# EAGLE design atmega_midi_pg800 (EAGLE 7.6.0)
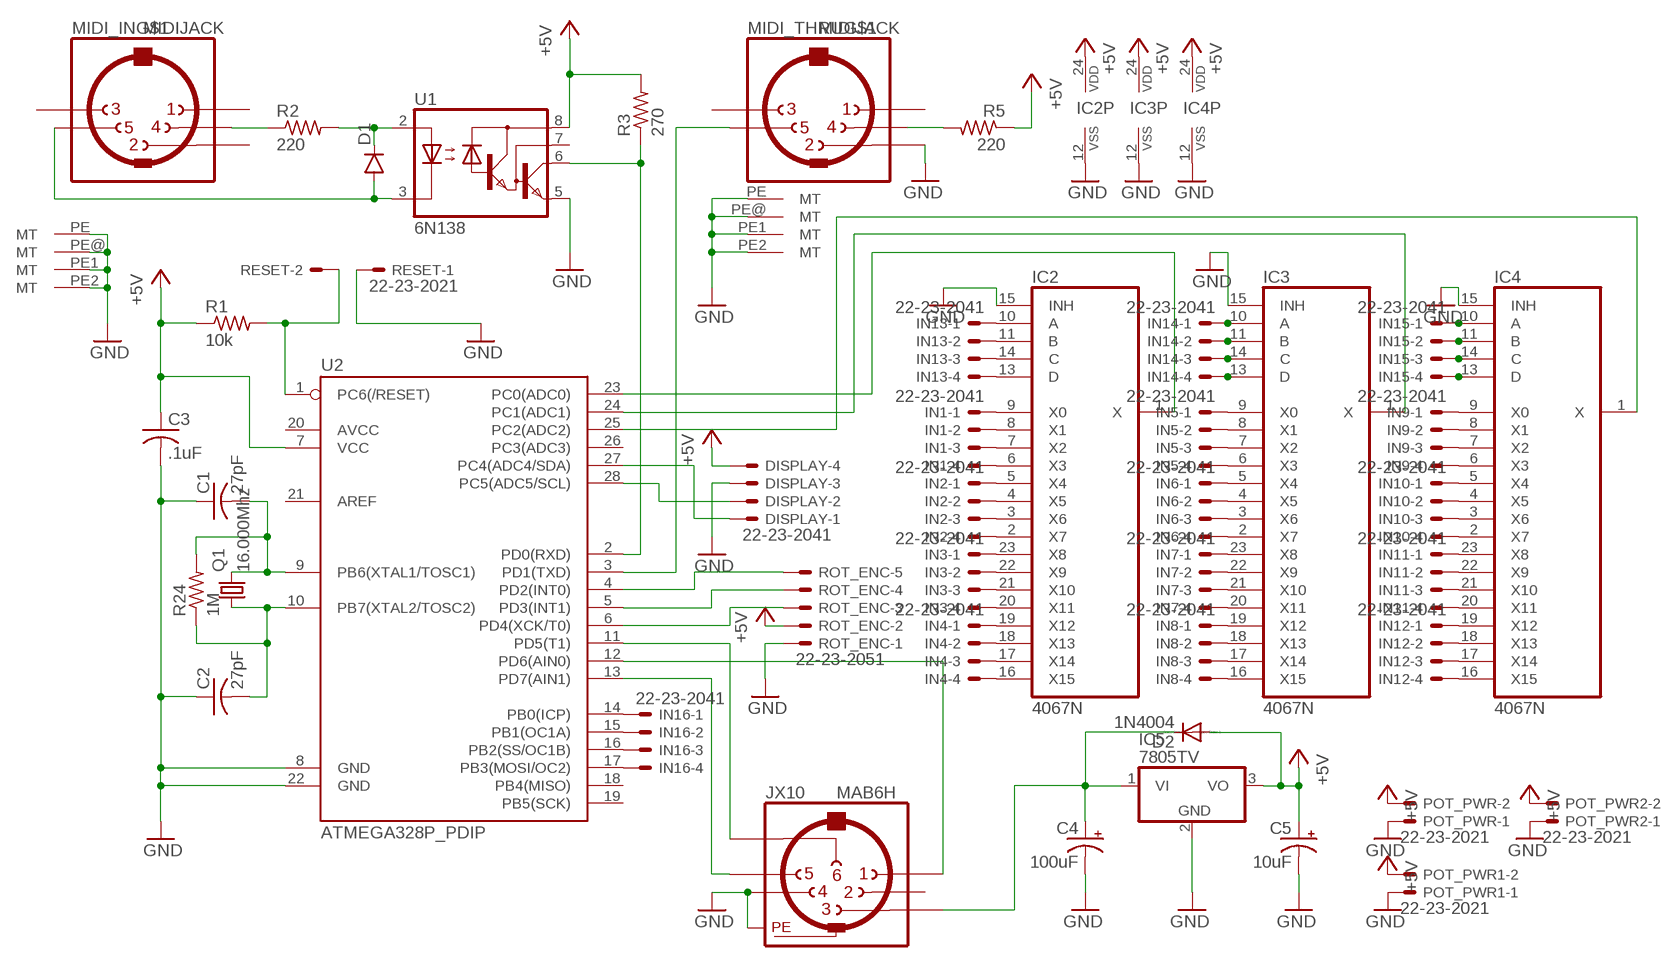
[diagram p0: schematic, sheet 1]

## Parts
C1  27pF  C-US025-040X050  [C025-040X050]
C2  27pF  C-US025-040X050  [C025-040X050]
C3  .1uF  C-US025-030X050  [C025-030X050]
C4  100uF  CPOL-USB45181A  [B45181A]
C5  10uF  CPOL-USB45181A  [B45181A]
D1  DIODE1N4148  [DIODE-1N4148]
D2  1N4004  [DO41-10]
DISPLAY  22-23-2041  [22-23-2041]
IC2  4067N  [DIL24-6]
IC3  4067N  [DIL24-6]
IC4  4067N  [DIL24-6]
IC5  7805TV  [TO220V]
IN1  22-23-2041  [22-23-2041]
IN2  22-23-2041  [22-23-2041]
IN3  22-23-2041  [22-23-2041]
IN4  22-23-2041  [22-23-2041]
IN5  22-23-2041  [22-23-2041]
IN6  22-23-2041  [22-23-2041]
IN7  22-23-2041  [22-23-2041]
IN8  22-23-2041  [22-23-2041]
IN9  22-23-2041  [22-23-2041]
IN10  22-23-2041  [22-23-2041]
IN11  22-23-2041  [22-23-2041]
IN12  22-23-2041  [22-23-2041]
IN13  22-23-2041  [22-23-2041]
IN14  22-23-2041  [22-23-2041]
IN15  22-23-2041  [22-23-2041]
IN16  22-23-2041  [22-23-2041]
JX10  MAB6H  [MAB6H]
MIDI_IN  MIDIJACK  [CP-2350]
MIDI_THRU  MIDIJACK  [CP-2350]
POT_PWR  22-23-2021  [22-23-2021]
POT_PWR1  22-23-2021  [22-23-2021]
POT_PWR2  22-23-2021  [22-23-2021]
Q1  16.000Mhz  CRYSTALHC49S  [HC49/S]
R1  10k  R-US_0207/7  [0207/7]
R2  220  R-US_0207/7  [0207/7]
R3  270  R-US_0207/7  [0207/7]
R5  220  R-US_0309/10  [0309/10]
R24  1M  R-US_0207/7  [0207/7]
RESET  22-23-2021  [22-23-2021]
ROT_ENC  22-23-2051  [22-23-2051]
U1  6N138  [DIL08]
U2  ATMEGA328P_PDIP  [DIL28-3]

## Nets
+5V: C3.1 C5.+ D2.A DISPLAY.4 IC2.24(VDD) IC3.24(VDD) IC4.24(VDD) IC5.3(VO) POT_PWR1.2 POT_PWR2.2 POT_PWR.2 R1.1 R3.2 R5.1 ROT_ENC.2 U1.8(VCC) U2.7(VCC)
GND: C1.1 C2.1 C3.2 C4.- C5.- DISPLAY.3 IC2.12(VSS) IC2.15(INH) IC3.12(VSS) IC3.15(INH) IC4.12(VSS) IC4.15(INH) IC5.2(GND) JX10.4 JX10.PE JX10.PE@(PE) MIDI_IN.PE1(MT) MIDI_IN.PE2(MT) MIDI_IN.PE(MT) MIDI_IN.PE@(MT) MIDI_THRU.2 MIDI_THRU.PE1(MT) MIDI_THRU.PE2(MT) MIDI_THRU.PE(MT) MIDI_THRU.PE@(MT) POT_PWR1.1 POT_PWR2.1 POT_PWR.1 RESET.1 ROT_ENC.1 U1.5(GND) U2.8(GND) U2.22(GND)
N$1: MIDI_THRU.4 R5.2
N$2: IC4.1(X) U2.25(PC2(ADC2))
N$3: D1.A MIDI_IN.5 U1.3(C)
N$4: C1.2 Q1.2 R24.2 U2.9(PB6(XTAL1/TOSC1))
N$5: C2.2 Q1.1 R24.1 U2.10(PB7(XTAL2/TOSC2))
N$6: C4.+ D2.C IC5.1(VI) JX10.3
N$7: D1.C R2.2 U1.2(A)
N$8: MIDI_IN.4 R2.1
N$9: JX10.6 U2.11(PD5(T1))
N$10: JX10.1 U2.12(PD6(AIN0))
N$11: JX10.5 U2.13(PD7(AIN1))
N$12: DISPLAY.2 U2.28(PC5(ADC5/SCL))
N$13: DISPLAY.1 U2.27(PC4(ADC4/SDA))
N$14: IC3.1(X) U2.24(PC1(ADC1))
N$15: IC2.1(X) U2.23(PC0(ADC0))
N$16: IN16.1 U2.14(PB0(ICP))
N$17: IN16.2 U2.15(PB1(OC1A))
N$18: IC3.10(A) IN14.1
N$19: IC3.11(B) IN14.2
N$20: IC2.9(X0) IN1.1
N$21: IC2.8(X1) IN1.2
N$22: IC2.7(X2) IN1.3
N$23: IC2.6(X3) IN1.4
N$24: IC2.5(X4) IN2.1
N$25: IC2.4(X5) IN2.2
N$26: IC2.3(X6) IN2.3
N$27: IC2.2(X7) IN2.4
N$28: IC2.23(X8) IN3.1
N$29: IC2.22(X9) IN3.2
N$30: R3.1 U1.6(VO) U2.2(PD0(RXD))
N$31: IC2.21(X10) IN3.3
N$32: IC2.20(X11) IN3.4
N$33: IC2.19(X12) IN4.1
N$34: IC2.18(X13) IN4.2
N$35: IC2.17(X14) IN4.3
N$36: IC2.16(X15) IN4.4
N$37: IC3.9(X0) IN5.1
N$38: IC3.8(X1) IN5.2
N$39: IC3.7(X2) IN5.3
N$40: IC3.6(X3) IN5.4
N$41: IC3.5(X4) IN6.1
N$42: MIDI_THRU.5 U2.3(PD1(TXD))
N$43: R1.2 RESET.2 U2.1(PC6(/RESET))
N$44: IC3.4(X5) IN6.2
N$45: IC3.3(X6) IN6.3
N$46: IC3.2(X7) IN6.4
N$47: IC3.23(X8) IN7.1
N$48: IC3.22(X9) IN7.2
N$49: IC3.21(X10) IN7.3
N$50: IC3.20(X11) IN7.4
N$51: IC3.19(X12) IN8.1
N$52: IC3.18(X13) IN8.2
N$53: IC3.17(X14) IN8.3
N$54: IC3.16(X15) IN8.4
N$55: IC4.9(X0) IN9.1
N$56: IC4.8(X1) IN9.2
N$57: IC4.7(X2) IN9.3
N$58: IC4.6(X3) IN9.4
N$59: IC4.5(X4) IN10.1
N$60: IC4.4(X5) IN10.2
N$61: IC4.3(X6) IN10.3
N$62: IC4.2(X7) IN10.4
N$63: IC4.23(X8) IN11.1
N$64: IC4.22(X9) IN11.2
N$65: IC4.21(X10) IN11.3
N$66: IC4.20(X11) IN11.4
N$67: IC4.19(X12) IN12.1
N$68: IC4.18(X13) IN12.2
N$69: IC4.17(X14) IN12.3
N$70: IC4.16(X15) IN12.4
N$71: IC3.14(C) IN14.3
N$72: IC3.13(D) IN14.4
N$73: IC4.10(A) IN15.1
N$74: IC4.11(B) IN15.2
N$75: IC4.14(C) IN15.3
N$76: IC4.13(D) IN15.4
N$77: IN16.3 U2.16(PB2(SS/OC1B))
N$78: IN16.4 U2.17(PB3(MOSI/OC2))
N$80: IC2.13(D) IN13.4
N$81: IC2.14(C) IN13.3
N$82: IC2.11(B) IN13.2
N$83: IC2.10(A) IN13.1
N$84: ROT_ENC.5 U2.4(PD2(INT0))
N$85: ROT_ENC.4 U2.5(PD3(INT1))
N$86: ROT_ENC.3 U2.6(PD4(XCK/T0))
Unconnected: JX10.2 MIDI_IN.1 MIDI_IN.2 MIDI_IN.3 MIDI_THRU.1 MIDI_THRU.3 U1.7(VB) U2.18(PB4(MISO)) U2.19(PB5(SCK)) U2.20(AVCC) U2.21(AREF) U2.26(PC3(ADC3))

## Library data of the parts
C1-C3 = rcl:C-US: CAPACITOR, American symbol
C4 C5 = rcl:CPOL-US: POLARIZED CAPACITOR, American symbol
D1 = SparkFun-DiscreteSemi:DIODE: Diode These are standard reverse protection diodes and small signal diodes. SMA package can handle up to about 1A. SOD-323 can handle about 200mA. What the SOD-323 package when ordering, there are some mfgs out there that are 5-pin packages.
D2 = diode:1N4004: DIODE general purpose rectifier, 1 A
DISPLAY IN1-IN16 = con-molex:22-23-2041: .100" (2.54mm) Center Header - 4 Pin; MF: MOLEX; MPN: 22-23-2041; OC_FARNELL: 1462920; OC_NEWARK: 38C0355
IC2-IC4 = 40xx:4067: 16-channel ANALOG MULTIPLEXER
IC5 = linear:78*: Positive VOLTAGE REGULATOR Source: http://cache.national.com/ds/LM/LM78L05.pdf http://www.fairchildsemi.com/ds/LM/LM7805.pdf
JX10 = con-hirschmann:MAB6H: Female CONNECTOR 6 pins with shield, horizontal (DIN 45322); MF: FARNELL; MPN: MAB 6 H; OC_FARNELL: 809901; OC_NEWARK: 67C7887
MIDI_IN MIDI_THRU = adafruit:MIDIJACK: DIN 5 jack also known as MIDI jack A modification of conn-hirshman:MAB5SH with two options for the grounding 'teeth'
POT_PWR POT_PWR1 POT_PWR2 RESET = con-molex:22-23-2021: .100" (2.54mm) Center Header - 2 Pin; MF: MOLEX; MPN: 22-23-2021; OC_FARNELL: 1462926; OC_NEWARK: 25C3832
Q1 = crystal:CRYSTAL: CRYSTAL; OC_FARNELL: 1667008; OC_NEWARK: unknown
R1-R3 R5 R24 = rcl:R-US_: RESISTOR, American symbol
ROT_ENC = con-molex:22-23-2051: .100" (2.54mm) Center Header - 5 Pin; MF: MOLEX; MPN: 22-23-2051; OC_FARNELL: 1462952; OC_NEWARK: 38C9178
U1 = optocoupler:6N138: MOTOROLA OPTO COUPLER; MF: VISHAY/TELEFUNKEN; MPN: 6N138; OC_FARNELL: 9860150; OC_NEWARK: 35K5294
U2 = SparkFun-DigitalIC:ATMEGA328P_PDIP: uC used in the Arduino 32kb flash, 1k EEPROM, 2k SRAM This is the through-hole version of this chip.

## Net classes
1 GND: width 1.016 mm, drill 1.016 mm, clearance 0.508 mm

## Board
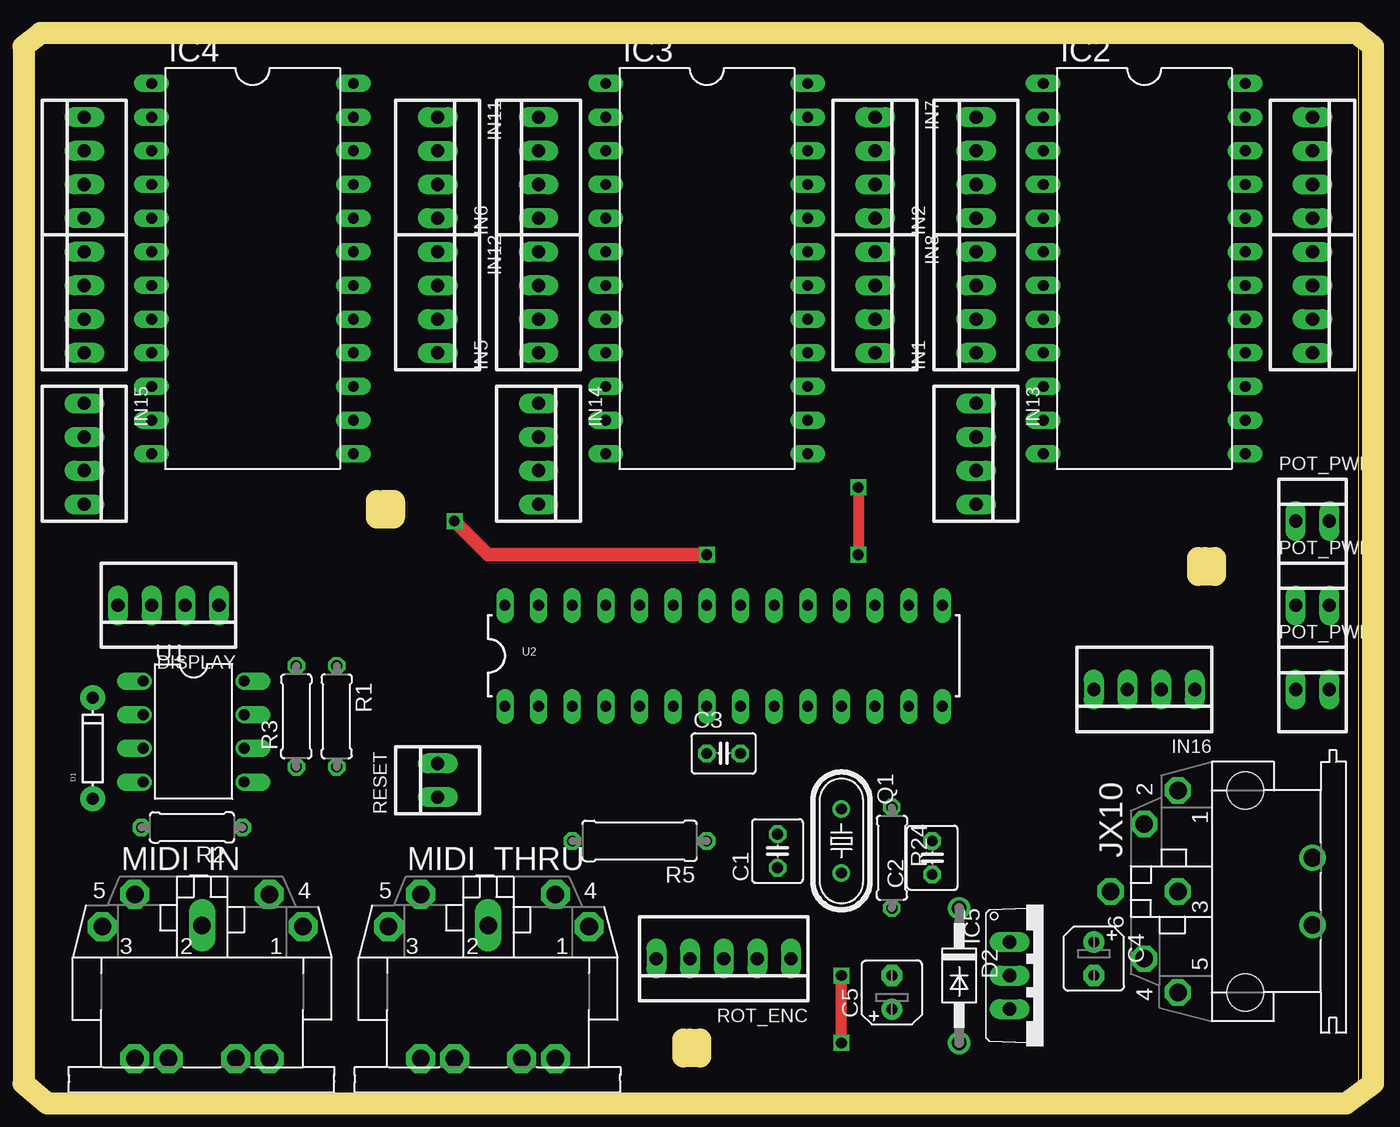
[diagram p1: board, top side]
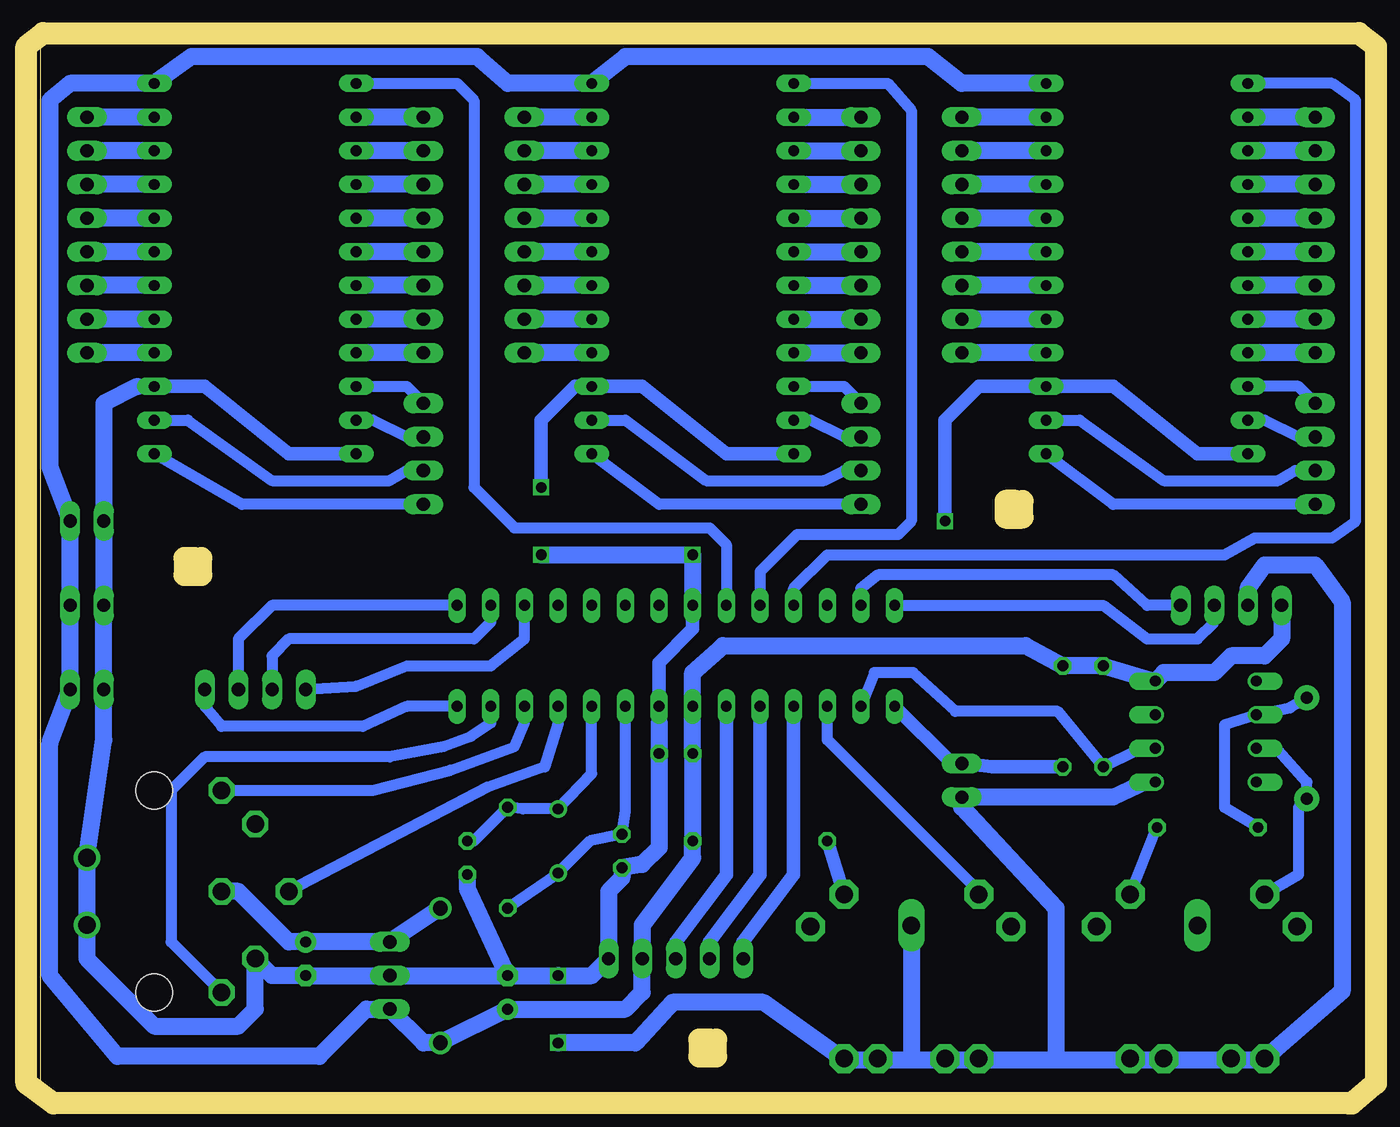
[diagram p2: board, bottom side, seen from below]

Size 100 x 80 mm. Coordinates in mm from the lower left corner, seen from the top.
Outline: 0,0 100,0 100,80 0,80 0,0
Copper layers (1*16): Top 0.035mm / dielectric 1.5mm / Bottom 0.035mm
Design rules "default *": minimum track width 32mil, minimum drill 31mil, track to track 18mil, track to pad 18mil, pad to pad 18mil, via to via 18mil, smd to smd 8mil, copper to edge 0mil, drill to drill 18mil, minimum pad ring 10mil, minimum via ring 8mil, stop-mask expansion 4mil, vias tented up to drill 0mil, thermal gap 10mil
Milling: 20 lines

### Footprints (pad centres in the part's own frame; a part is rotated, then mirrored left to right if it is on the bottom)
C025-040X050 = drill 0.813 octagon: 1 -1.27,0; 2 1.27,0
C025-030X050 = drill 0.813 octagon: 1 -1.27,0; 2 1.27,0
B45181A = drill 0.813 pad 1.6: + -1.27,0 | drill 0.813 pad 1.6 octagon: - 1.27,0
DIODE-1N4148 = drill 0.9 pad 1.88: A -3.81,0; C 3.81,0
DO41-10 = drill 1.118: A 5.08,0; C -5.08,0
22-23-2041 = drill 1 long: 1 -3.81,0; 2 -1.27,0; 3 1.27,0; 4 3.81,0
DIL24-6 = drill 0.813 long: 1 -13.97,-7.62; 2 -11.43,-7.62; 3 -8.89,-7.62; 4 -6.35,-7.62; 5 -3.81,-7.62; 6 -1.27,-7.62; 7 1.27,-7.62; 8 3.81,-7.62; 9 6.35,-7.62; 10 8.89,-7.62; 11 11.43,-7.62; 12 13.97,-7.62; 13 13.97,7.62; 14 11.43,7.62; 15 8.89,7.62; 16 6.35,7.62; 17 3.81,7.62; 18 1.27,7.62; 19 -1.27,7.62; 20 -3.81,7.62; 21 -6.35,7.62; 22 -8.89,7.62; 23 -11.43,7.62; 24 -13.97,7.62
TO220V = drill 1.016 long: 1 -2.54,-2.54; 2 0,-2.54; 3 2.54,-2.54
MAB6H = drill 1.321 octagon: 1 7.62,5.08; 2 5.08,7.62; 3 0,5.08; 4 -5.08,7.62; 5 -7.62,5.08; 6 0,10.16 | drill 1.321: PE -2.54,-5.08; PE@ 2.54,-5.08 | hole 2.794: 7.62,0; -7.62,0
CP-2350 = drill 1.321 pad 2.184 octagon: 1 7.62,12.58; 3 -7.52,12.58; 4 5.08,15.02; 5 -5.08,15.02; PE -2.54,2.62; PE1 -5.08,2.62; PE2 5.08,2.62; PE@ 2.54,2.62 | drill 1.321 long: 2 0,12.68
22-23-2021 = drill 1 long: 1 -1.27,0; 2 1.27,0
HC49/S = drill 0.813: 1 -2.413,0; 2 2.413,0
0207/7 = drill 0.813 octagon: 1 -3.81,0; 2 3.81,0
0309/10 = drill 0.813 octagon: 1 -5.08,0; 2 5.08,0
22-23-2051 = drill 1 long: 1 -5.08,0; 2 -2.54,0; 3 0,0; 4 2.54,0; 5 5.08,0
DIL08 = drill 0.813 offset: 1 -3.81,-3.81; 2 -1.27,-3.81; 3 1.27,-3.81; 4 3.81,-3.81; 5 3.81,3.81; 6 1.27,3.81; 7 -1.27,3.81; 8 -3.81,3.81
DIL28-3 = drill 0.813 long: 1 -16.51,-3.81; 2 -13.97,-3.81; 3 -11.43,-3.81; 4 -8.89,-3.81; 5 -6.35,-3.81; 6 -3.81,-3.81; 7 -1.27,-3.81; 8 1.27,-3.81; 9 3.81,-3.81; 10 6.35,-3.81; 11 8.89,-3.81; 12 11.43,-3.81; 13 13.97,-3.81; 14 16.51,-3.81; 15 16.51,3.81; 16 13.97,3.81; 17 11.43,3.81; 18 8.89,3.81; 19 6.35,3.81; 20 3.81,3.81; 21 1.27,3.81; 22 -1.27,3.81; 23 -3.81,3.81; 24 -6.35,3.81; 25 -8.89,3.81; 26 -11.43,3.81; 27 -13.97,3.81; 28 -16.51,3.81

### Placement (x,y rotation side)
C1  56.13,18.29 90 top
C2  67.82,17.78 90 top
C3  52.07,25.65 0 top
C4  80.01,10.16 270 top
C5  64.77,7.62 90 top
D1  4.45,26.04 90 top
D2  69.85,8.89 270 top
DISPLAY  10.16,36.83 180 top
IC2  83.82,62.23 270 top
IC3  50.8,62.23 270 top
IC4  16.51,62.23 270 top
IC5  76.2,8.89 270 top
IN1  71.12,59.69 90 top
IN2  71.12,69.85 90 top
IN3  96.52,69.85 270 top
IN4  96.52,59.69 270 top
IN5  38.1,59.69 90 top
IN6  38.1,69.85 90 top
IN7  63.5,69.85 270 top
IN8  63.5,59.69 270 top
IN9  3.81,59.69 90 top
IN10  3.81,69.85 90 top
IN11  30.48,69.85 270 top
IN12  30.48,59.69 270 top
IN13  71.12,48.26 270 top
IN14  38.1,48.26 270 top
IN15  3.81,48.26 270 top
IN16  83.82,30.48 180 top
JX10  91.44,15.24 90 top
MIDI_IN  12.7,0 0 top
MIDI_THRU  34.29,0 0 top
POT_PWR  96.52,36.83 0 top
POT_PWR1  96.52,30.48 0 top
POT_PWR2  96.52,43.18 0 top
Q1  60.96,19.05 270 top
R1  22.86,28.45 270 top
R2  11.94,20.07 180 top
R3  19.81,28.45 90 top
R5  45.72,19.05 180 top
R24  64.77,17.78 270 top
RESET  30.48,23.62 90 top
ROT_ENC  52.07,10.16 180 top
U1  12.06,27.3 270 top
U2  52.07,33.02 0 top

### Tracks (layer width: path | path; a pad name or v marks a point on that pad's centre or on a via)
+5V
  Bottom 1.016: 50.8,28.19 U2.7
  Bottom 1.27: IC4.24 30.48,76.2 33.02,78.23 55.88,78.23 IC3.24 64.77,76.2 67.06,78.23 88.65,78.23 IC2.24 97.79,76.2 99.31,74.93 99.31,47.24 POT_PWR2.2 POT_PWR.2 POT_PWR1.2 99.31,26.42 99.31,8.89 94.23,2.79 78.99,2.79 75.44,6.35 IC5.3 71.12,3.81 D2.A C5.+ 55.88,6.35 54.61,7.62 ROT_ENC.2 54.61,12.7 50.8,17.78 R5.1 C3.1 U2.7 50.8,31.75 48.51,33.78 25.65,33.78 R1.1 R3.2 U1.8 15.24,31.75 11.43,31.75 10.16,33.02 7.62,33.02 6.35,34.29 DISPLAY.4
GND  (via drill 0.8)
  Top 0.813: v62.23,45.72 v62.23,40.64 | v60.96,3.81 v60.96,8.89
  Top 1.016: v31.75,43.18 34.29,40.64 v50.8,40.64
  Bottom 0.813: U2.22 50.8,36.2 | 7.62,2.54 MIDI_IN.PE1 | 10.16,2.54 MIDI_IN.PE | 15.24,2.54 MIDI_IN.PE@ MIDI_IN.PE2 17.78,2.54 | 39.37,2.54 MIDI_THRU.PE2 | 31.75,2.54 MIDI_THRU.PE | 36.83,2.54 MIDI_THRU.PE@ | 29.21,2.54 MIDI_THRU.PE1 | U2.8 53.34,27.94 | IC2.15 92.71,53.34
  Bottom 1.016: DISPLAY.3 8.89,38.1 | IC3.12 48.26,48.26 54.61,53.34 IC3.15 59.69,53.34 62.23,50.8 v62.23,45.72 | IC2.12 81.28,48.26 87.63,53.34 IC2.15 | 50.8,38.1 U2.22 50.8,35.05 53.34,32.51 U2.8 | 30.48,21.59 RESET.1 | IC4.12 12.7,48.26 19.05,53.34 IC4.15 29.21,53.34 31.75,50.8 v31.75,43.18
  Bottom 1.27: 7.62,2.54 10.16,2.54 15.24,2.54 23.37,2.54 | 34.29,2.54 36.83,2.54 39.37,2.54 45.47,6.86 52.32,6.86 55.12,3.81 v60.96,3.81 | 34.29,2.54 31.75,2.54 29.21,2.54 23.37,2.54 | MIDI_THRU.2 34.29,2.54 | 8.89,38.1 7.62,39.88 3.81,39.88 1.78,37.08 1.78,7.7 MIDI_IN.PE1 | v62.23,40.64 v50.8,40.64 U2.22 | 92.71,53.34 95.25,52.07 POT_PWR2.1 POT_PWR.1 POT_PWR1.1 95.25,26.67 JX10.PE@ JX10.PE 96.52,10.16 91.44,5.08 85.09,5.08 83.82,6.35 JX10.4 82.55,8.89 C4.- IC5.2 C5.- | 30.48,21.59 23.37,13.97 23.37,2.54 | C5.- v60.96,8.89 58.42,8.89 ROT_ENC.1 57.15,15.24 56.13,16.26 C1.1 54.61,17.27 53.34,18.54 C3.2 53.34,27.94 | C5.- 67.82,15.49 C2.1 | U1.5 16.64,23.5 19.05,22.35 RESET.1
N$1
  Bottom 1.016: MIDI_THRU.4 R5.2
N$2
  Bottom 0.813: U2.25 43.18,38.1 40.64,40.64 10.67,40.64 8.38,41.91 2.54,41.91 0.76,43.18 0.76,74.93 2.54,76.2 IC4.1
N$3
  Bottom 0.813: U1.3 7.87,25.91 6.6,25.91 4.45,23.5 D1.A 5.08,21.59 5.08,16.51 MIDI_IN.5
N$4
  Bottom 0.813: U2.9 55.88,21.34 C1.2 58.55,19.05 Q1.2 60.83,16.64 R24.2
N$5
  Bottom 0.813: C2.2 67.31,19.05 R24.1 63.63,21.46 Q1.1 58.42,24.13 U2.10
N$6
  Bottom 1.27: D2.C IC5.1 C4.+ 81.28,11.43 85.09,15.24 JX10.3
N$7
  Bottom 0.813: R2.2 10.67,21.59 10.67,27.81 U1.2 5.71,29.08 D1.C
N$8
  Bottom 0.813: MIDI_IN.4 R2.1
N$9
  Bottom 0.813: U2.11 60.96,27.94 61.98,24.64 66.29,23.11 JX10.6
N$10
  Bottom 0.813: JX10.1 74.93,22.86 69.09,24.38 64.26,26.16 63.5,27.94 U2.12
N$11
  Bottom 0.813: U2.13 66.04,27.94 67.56,26.92 69.6,26.16 73.66,25.4 87.63,25.4 90.17,22.86 90.17,11.43 JX10.5
N$12
  Bottom 0.813: U2.28 19.81,36.83 16.51,34.29 12.7,34.29 11.43,35.56 DISPLAY.2
N$13
  Bottom 0.813: DISPLAY.1 16.51,36.83 19.05,39.12 36.83,39.12 38.1,38.1 U2.27
N$14
  Bottom 0.813: IC3.1 36.07,76.2 34.29,74.17 34.29,43.18 35.31,42.16 42.93,42.16 45.72,39.37 U2.24
N$15
  Bottom 0.813: IC2.1 68.58,76.2 67.31,74.93 67.31,45.72 64.26,42.67 49.53,42.67 48.26,41.4 U2.23
N$16
  Bottom 0.813: U2.14 72.39,29.21 75.69,27.69 86.36,27.69 87.63,29.21 IN16.1
N$17
  Bottom 0.813: U2.15 82.55,36.83 85.09,34.29 IN16.2
N$18
  Bottom 0.813: IC3.10 39.37,53.34 IN14.1
N$19
  Bottom 0.813: IN14.2 39.37,49.53 41.91,50.8 IC3.11
N$20
  Bottom 1.27: IN1.1 IC2.9
N$21
  Bottom 1.27: IN1.2 IC2.8
N$22
  Bottom 1.27: IN1.3 IC2.7
N$23
  Bottom 1.27: IN1.4 IC2.6
N$24
  Bottom 1.27: IN2.1 IC2.5
N$25
  Bottom 1.27: IN2.2 IC2.4
N$26
  Bottom 1.27: IN2.3 IC2.3
N$27
  Bottom 1.27: IN2.4 IC2.2
N$28
  Bottom 1.27: IC2.23 IN3.1
N$29
  Bottom 1.27: IC2.22 IN3.2
N$30
  Bottom 0.813: U1.6 17.27,25.91 R3.1 23.24,28.83 30.99,28.83 34.16,31.75 37.08,31.75 U2.2
N$31
  Bottom 1.27: IC2.21 IN3.3
N$32
  Bottom 1.27: IC2.20 IN3.4
N$33
  Bottom 1.27: IC2.19 IN4.1
N$34
  Bottom 1.27: IC2.18 IN4.2
N$35
  Bottom 1.27: IC2.17 IN4.3
N$36
  Bottom 1.27: IC2.16 IN4.4
N$37
  Bottom 1.27: IC3.9 IN5.1
N$38
  Bottom 1.27: IC3.8 IN5.2
N$39
  Bottom 1.27: IC3.7 IN5.3
N$40
  Bottom 1.27: IC3.6 IN5.4
N$41
  Bottom 1.27: IC3.5 IN6.1
N$42
  Bottom 0.813: MIDI_THRU.5 29.21,15.24 40.64,26.67 U2.3
N$43
  Bottom 1.016: R1.2 28.19,24.64 RESET.2 31.24,24.89 U2.1
N$44
  Bottom 1.27: IC3.4 IN6.2
N$45
  Bottom 1.27: IC3.3 IN6.3
N$46
  Bottom 1.27: IC3.2 IN6.4
N$47
  Bottom 1.27: IC3.23 IN7.1
N$48
  Bottom 1.27: IC3.22 IN7.2
N$49
  Bottom 1.27: IC3.21 IN7.3
N$50
  Bottom 1.27: IC3.20 IN7.4
N$51
  Bottom 1.27: IC3.19 IN8.1
N$52
  Bottom 1.27: IC3.18 IN8.2
N$53
  Bottom 1.27: IC3.17 IN8.3
N$54
  Bottom 1.27: IC3.16 IN8.4
N$55
  Bottom 1.27: IN9.1 IC4.9
N$56
  Bottom 1.27: IN9.2 IC4.8
N$57
  Bottom 1.27: IN9.3 IC4.7
N$58
  Bottom 1.27: IN9.4 IC4.6
N$59
  Bottom 1.27: IN10.1 IC4.5
N$60
  Bottom 1.27: IN10.2 IC4.4
N$61
  Bottom 1.27: IN10.3 IC4.3
N$62
  Bottom 1.27: IN10.4 IC4.2
N$63
  Bottom 1.27: IC4.23 IN11.1
N$64
  Bottom 1.27: IC4.22 IN11.2
N$65
  Bottom 1.27: IC4.21 IN11.3
N$66
  Bottom 1.27: IC4.20 IN11.4
N$67
  Bottom 1.27: IC4.19 IN12.1
N$68
  Bottom 1.27: IC4.18 IN12.2
N$69
  Bottom 1.27: IC4.17 IN12.3
N$70
  Bottom 1.27: IC4.16 IN12.4
N$71
  Bottom 0.813: IC3.14 55.88,50.8 49.78,46.23 40.89,46.23 39.37,46.99 IN14.3
N$72
  Bottom 0.813: IN14.4 53.34,44.45 IC3.13
N$73
  Bottom 0.813: IN15.1 5.08,53.34 IC4.10
N$74
  Bottom 0.813: IC4.11 7.62,50.8 5.08,49.53 IN15.2
N$75
  Bottom 0.813: IC4.14 21.59,50.8 15.24,46.23 6.6,46.23 5.33,46.99 IN15.3
N$76
  Bottom 0.813: IN15.4 19.05,44.45 IC4.13
N$77
  Bottom 0.813: U2.16 66.04,35.56 67.31,34.29 81.28,34.29 82.55,33.02 IN16.3
N$78
  Bottom 0.813: IN16.4 76.2,30.73 72.39,32.26 66.04,32.26 63.5,34.29 U2.17
N$80
  Bottom 0.813: IN13.4 84.84,44.45 IC2.13
N$81
  Bottom 0.813: IC2.14 88.9,50.8 82.55,46.23 73.66,46.23 72.39,46.99 IN13.3
N$82
  Bottom 0.813: IC2.11 74.93,50.8 72.39,49.53 IN13.2
N$83
  Bottom 0.813: IC2.10 72.39,53.34 IN13.1
N$84
  Bottom 1.016: U2.4 43.18,16.51 46.99,11.43 ROT_ENC.5
N$85
  Bottom 1.016: ROT_ENC.4 49.53,11.43 45.72,16.51 U2.5
N$86
  Bottom 1.016: U2.6 48.26,16.51 52.07,11.43 ROT_ENC.3